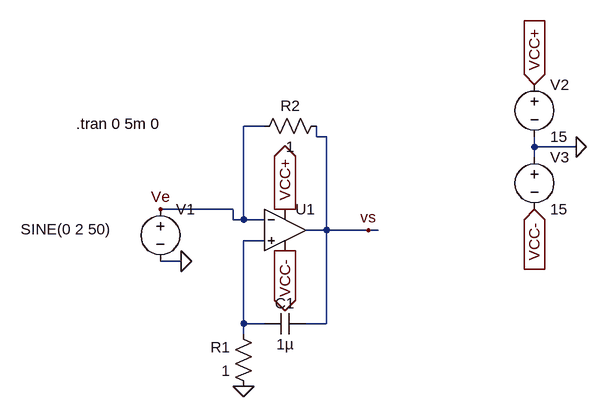
[diagram p0: schematic TP.asc]
TP.asc, the LTspice schematic file:
Version 4
SHEET 1 880 680
WIRE 80 -16 48 -16
WIRE 160 0 160 -16
WIRE 176 0 160 0
WIRE 496 16 496 0
WIRE 560 16 496 16
WIRE 496 32 496 16
WIRE 32 112 -80 112
WIRE 32 128 32 112
WIRE 48 128 48 -16
WIRE 48 128 32 128
WIRE 80 128 48 128
WIRE 176 144 176 0
WIRE 176 144 144 144
WIRE 240 144 176 144
WIRE 256 144 240 144
WIRE 80 160 48 160
WIRE -48 192 -80 192
WIRE 48 288 48 160
WIRE 80 288 48 288
WIRE 176 288 176 144
WIRE 176 288 144 288
WIRE 48 304 48 288
FLAG -80 112 Ve
FLAG 48 384 0
FLAG -48 192 0
FLAG 560 16 0
FLAG 496 -80 VCC+
IOPIN 496 -80 In
FLAG 496 112 VCC-
IOPIN 496 112 In
FLAG 112 176 VCC-
IOPIN 112 176 Out
FLAG 112 112 VCC+
IOPIN 112 112 Out
FLAG 240 144 vs
SYMBOL voltage -80 96 R0
WINDOW 3 -215 47 Left 2
WINDOW 123 0 0 Left 0
WINDOW 39 0 0 Left 0
SYMATTR InstName V1
SYMATTR Value SINE(0 2 50)
SYMBOL OpAmps\\UniversalOpAmp 112 144 R0
SYMATTR InstName U1
SYMBOL cap 144 272 R90
WINDOW 0 0 32 VBottom 2
WINDOW 3 32 32 VTop 2
SYMATTR InstName C1
SYMATTR Value 1µ
SYMBOL res 64 400 R180
WINDOW 0 36 76 Left 2
WINDOW 3 36 40 Left 2
SYMATTR InstName R1
SYMATTR Value 1
SYMBOL voltage 496 -96 R0
WINDOW 123 0 0 Left 0
WINDOW 39 0 0 Left 0
SYMATTR InstName V2
SYMATTR Value 15
SYMBOL voltage 496 16 R0
WINDOW 123 0 0 Left 0
WINDOW 39 0 0 Left 0
SYMATTR InstName V3
SYMATTR Value 15
SYMBOL res 176 -32 R90
WINDOW 0 0 56 VBottom 2
WINDOW 3 32 56 VTop 2
SYMATTR InstName R2
SYMATTR Value 1
TEXT -210 -20 Left 2 !.tran 0 5m 0

The netlist it stands for:
* TP.asc
V1 Ve 0 SINE(0 2 50)
XU1 N001 Ve VCC+ VCC- vs level1 Avol=1Meg GBW=10Meg Vos=0 En=0 Enk=0 In=0 Ink=0 Rin=500Meg  ; pins In+ In- V+ V- OUT
C1 vs N001 1µ
R1 0 N001 1
V2 VCC+ 0 15
V3 0 VCC- 15
R2 vs Ve 1
.tran 0 5m 0
.lib UniversalOpAmp1.lib
.backanno
.end

* Results of the author's LTspice run, read from the files saved beside the schematic
* Operating Point, zero values left out:
*   V(vcc+) = 15 V
*   V(vcc-) = -15 V
*   I(V3) = -30 nA
*   I(V2) = -30 nA
*   Ix(u1:3) = 30 nA
*   Ix(u1:4) = -30 nA